# EAGLE schematic untitled (EAGLE 5.11)
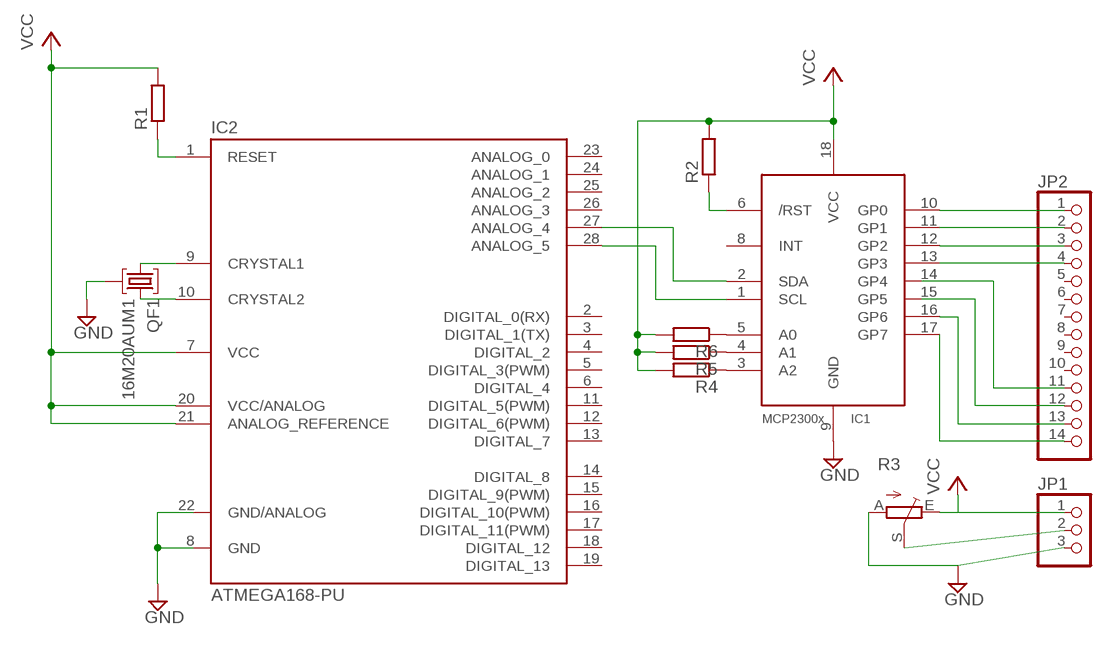
[diagram p0: schematic, sheet 1]

## Parts
IC1  MCP2300X/P  [DIL18]
IC2  ATMEGA168-PU  [DIL28-3]
JP1  PINHD-1X3CB  [1X03-CLEANBIG]
JP2  PINHD-1X14-CB  [1X14-CB]
QF1  16M20AUM1  [UM1]
R1  R-EU_0204/5  [0204/5]
R2  R-EU_0204/5  [0204/5]
R3  TRIM_EU-B25P  [B25P]
R4  R-EU_0204/5  [0204/5]
R5  R-EU_0204/5  [0204/5]
R6  R-EU_0204/5  [0204/5]

## Nets
GND: IC1.9(GND) JP1.3 QF1.2 R3.A
N$1: IC2.1(RESET) R1.1
N$2: IC1.10(GP0) JP2.1
N$3: IC1.11(GP1) JP2.2
N$4: IC2.9(CRYSTAL1) QF1.1
N$5: IC2.10(CRYSTAL2) QF1.3
N$6: IC1.1(SCL) IC2.28(ANALOG_5)
N$7: IC1.2(SDA) IC2.27(ANALOG_4)
N$8: IC1.6(/RST) R2.1
N$9: IC1.3(A2) R4.1
N$10: IC1.4(A1) R5.1
N$11: IC1.5(A0) R6.1
N$12: IC1.12(GP2) JP2.3
N$13: IC1.13(GP3) JP2.4
N$14: JP2.11
N$15: JP2.12
N$16: IC1.16(GP6) JP2.13
N$17: IC1.17(GP7) JP2.14
N$19: JP1.2 R3.S
VCC: IC1.18(VCC) IC2.7(VCC) IC2.20(VCC/ANALOG) IC2.21(ANALOG_REFERENCE) JP1.1 R1.2 R2.2 R3.E R4.2 R5.2 R6.2
Unconnected: IC1.8(INT) IC1.14(GP4) IC1.15(GP5) IC2.2(DIGITAL_0(RX)) IC2.3(DIGITAL_1(TX)) IC2.4(DIGITAL_2) IC2.5(DIGITAL_3(PWM)) IC2.6(DIGITAL_4) IC2.11(DIGITAL_5(PWM)) IC2.12(DIGITAL_6(PWM)) IC2.13(DIGITAL_7) IC2.14(DIGITAL_8) IC2.15(DIGITAL_9(PWM)) IC2.16(DIGITAL_10(PWM)) IC2.17(DIGITAL_11(PWM)) IC2.18(DIGITAL_12) IC2.19(DIGITAL_13) IC2.23(ANALOG_0) IC2.24(ANALOG_1) IC2.25(ANALOG_2) IC2.26(ANALOG_3) JP2.5 JP2.6 JP2.7 JP2.8 JP2.9 JP2.10

## Power pins joined to a net without a drawn wire
GND: IC2.8(GND)
GND/ANALOG: IC2.22(GND/ANALOG)

## Library data of the parts
IC1 = adafruit:MCP2300X: MCP23008 Inexpensive i2c i/o expander - 8 general purpose i/o pins with optional pullups
IC2 = Arduino-AVR:ATMEGA168-PU
JP1 = adafruit:PINHD-1X3: PIN HEADER
JP2 = adafruit:PINHD-1X14: PIN HEADER
QF1 = crystal:16M20AUM1: Monolithic Crystal Filters Source: www.vanlong.com; OC_FARNELL: unknown; OC_NEWARK: unknown
R1 R2 R4-R6 = resistor:R-EU_: RESISTOR, European symbol
R3 = pot:TRIM_EU-: POTENTIOMETER